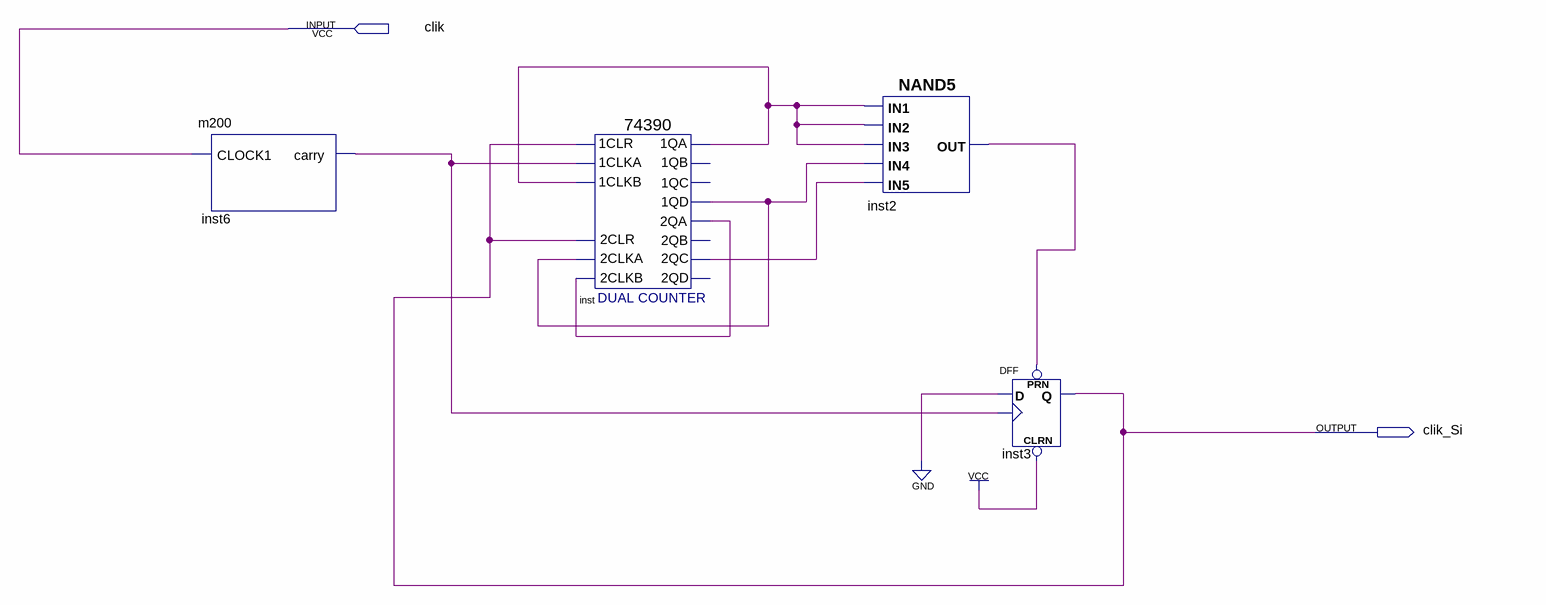
[diagram p0: schematic sheet]
// Quartus schematic Si.bdf as structural Verilog: 4 symbols, 2 pins
module Si (
  input  clik,
  output clik_Si
);

  wire inst2_out, inst6_carry, inst_1qa, inst_1qd, inst_2qa, inst_2qc;

  m200 inst6 (.CLOCK1(clik), .carry(inst6_carry));
  \74390  inst (
    .\2CLKA (inst_1qd), .\2CLR (clik_Si), .\2CLKB (inst_2qa), .\1CLR (clik_Si), .\1CLKA (inst6_carry),
    .\1CLKB (inst_1qa), .\1QA (inst_1qa), .\1QD (inst_1qd), .\2QA (inst_2qa), .\2QC (inst_2qc));  // open: 1QB, 1QC, 2QB, 2QD
  nand inst2 (inst2_out, inst_1qa, inst_1qa, inst_1qa, inst_1qd, inst_2qc);
  DFF inst3 (.CLRN(1'b1), .CLK(inst6_carry), .D(1'b0), .PRN(inst2_out), .Q(clik_Si));
endmodule
